# EAGLE design Avionics_Main_Board (EAGLE 9.2.2)

## Sheet 1 of 3
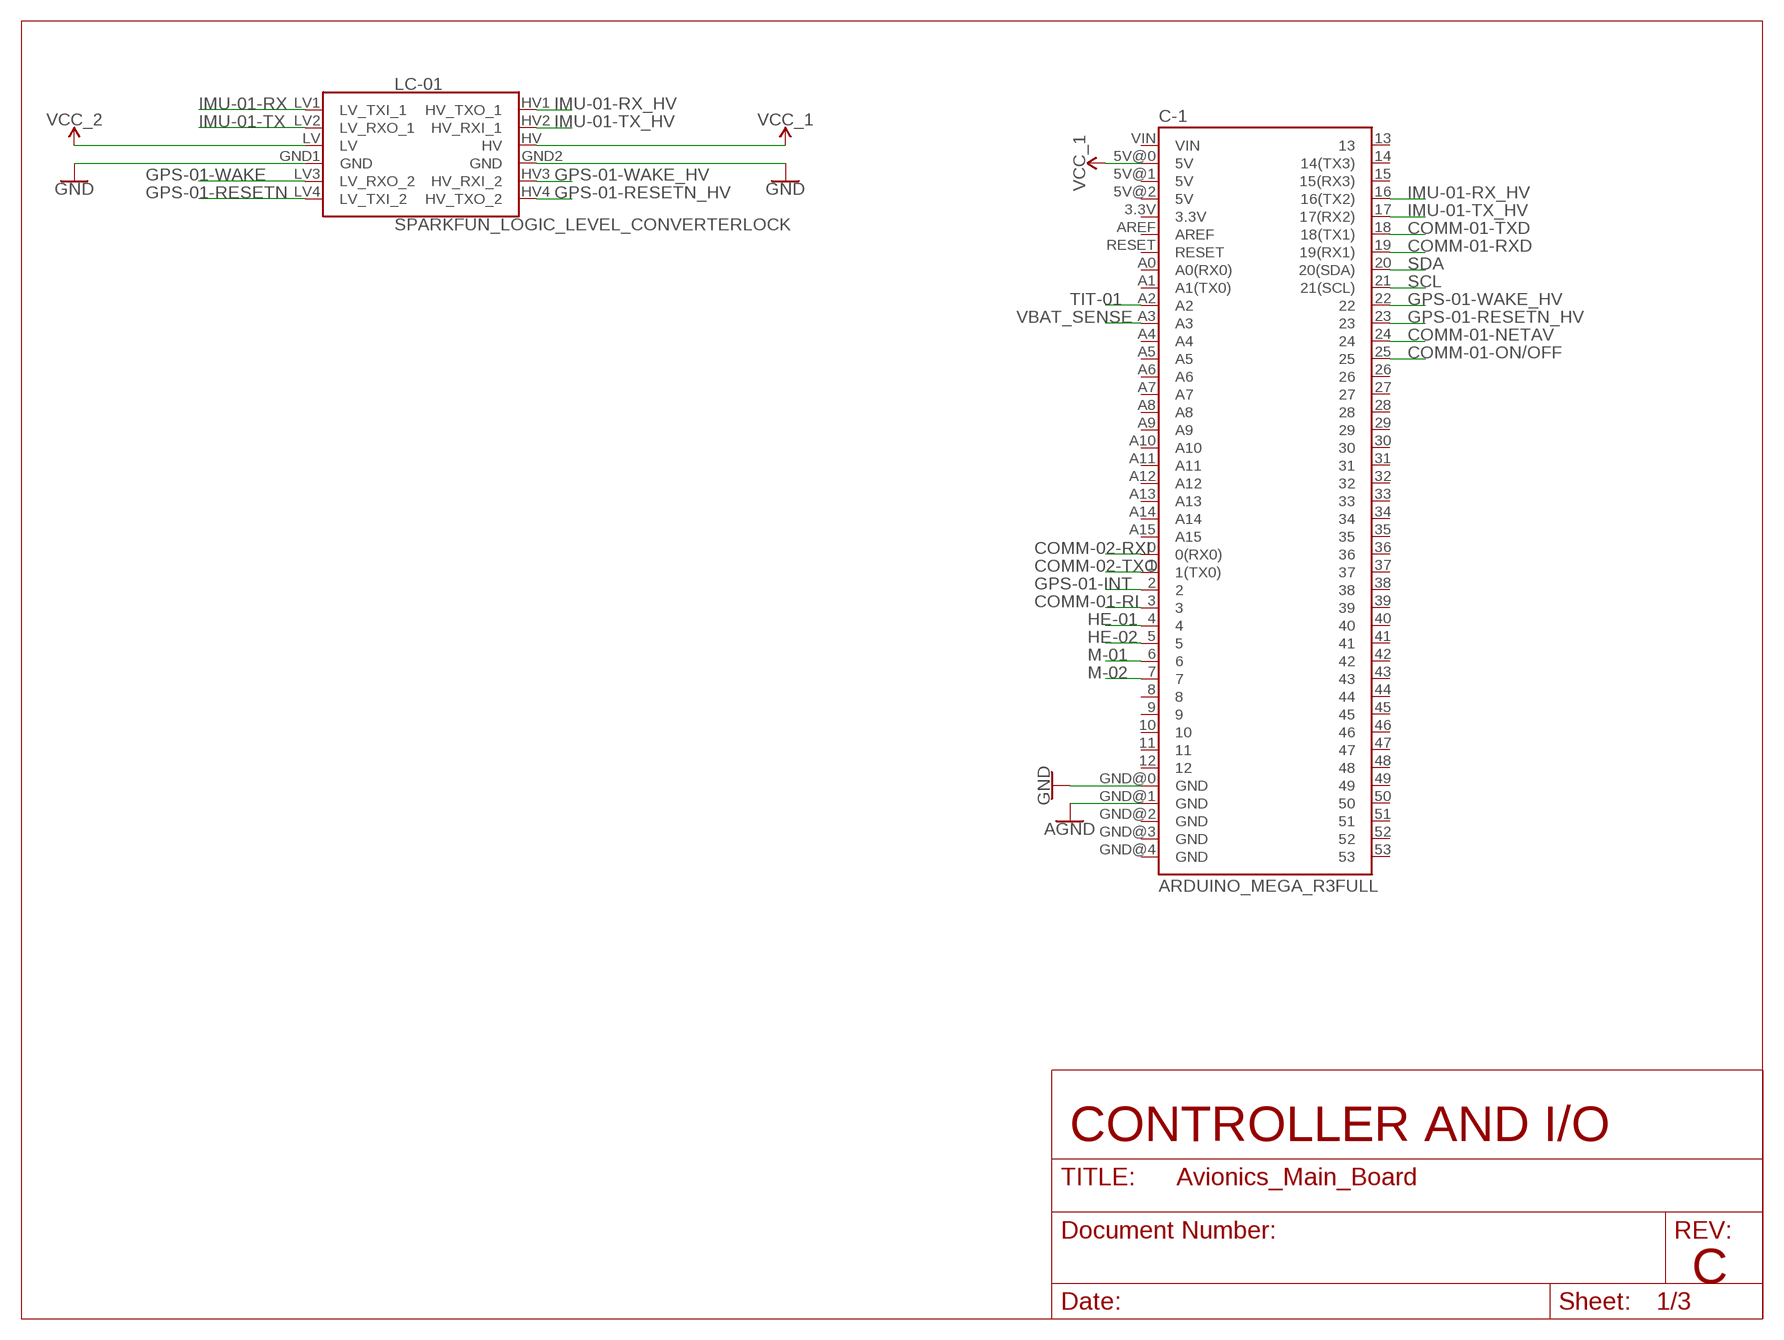
[diagram p0: schematic, sheet 1]

### Parts
C-1  ARDUINO_MEGA_R3FULL  [ARDUINO_MEGA]
LC-01  SPARKFUN_LOGIC_LEVEL_CONVERTERLOCK  [SPARKFUN_LOGIC_LEVEL_CONVERTER_LOCK]

### Nets
AGND: C-1.GND@1(GND) ; also sheet 3
COMM-01-NETAV: C-1.24 ; also sheet 3
COMM-01-ON/OFF: C-1.25 ; also sheet 3
COMM-01-RI: C-1.3 ; also sheet 3
COMM-01-RXD: C-1.19(19(RX1)) ; also sheet 3
COMM-01-TXD: C-1.18(18(TX1)) ; also sheet 3
COMM-02-RXI: C-1.0(0(RX0)) ; also sheet 3
COMM-02-TXO: C-1.1(1(TX0)) ; also sheet 3
GND: C-1.GND@0(GND) LC-01.GND1(GND) LC-01.GND2(GND) ; also sheet 2,3
GPS-01-INT: C-1.2 ; also sheet 3
GPS-01-RESETN: LC-01.LV4(LV_TXI_2) ; also sheet 3
GPS-01-RESETN_HV: C-1.23 LC-01.HV4(HV_TXO_2)
GPS-01-WAKE: LC-01.LV3(LV_RXO_2) ; also sheet 3
GPS-01-WAKE_HV: C-1.22 LC-01.HV3(HV_RXI_2)
HE-01: C-1.4 ; also sheet 2
HE-02: C-1.5 ; also sheet 2
IMU-01-RX: LC-01.LV1(LV_TXI_1) ; also sheet 3
IMU-01-RX_HV: C-1.16(16(TX2)) LC-01.HV1(HV_TXO_1)
IMU-01-TX: LC-01.LV2(LV_RXO_1) ; also sheet 3
IMU-01-TX_HV: C-1.17(17(RX2)) LC-01.HV2(HV_RXI_1)
M-01: C-1.6 ; also sheet 2
M-02: C-1.7 ; also sheet 2
SCL: C-1.21(21(SCL)) ; also sheet 3
SDA: C-1.20(20(SDA)) ; also sheet 3
TIT-01: C-1.A2 ; also sheet 3
VBAT_SENSE: C-1.A3 ; also sheet 3
VCC_1 [power]: C-1.5V@0(5V) LC-01.HV ; also sheet 2,3
VCC_2 [power]: LC-01.LV ; also sheet 2,3
Unconnected: C-1.3.3V C-1.5V@1(5V) C-1.5V@2(5V) C-1.8 C-1.9 C-1.10 C-1.11 C-1.12 C-1.13 C-1.14(14(TX3)) C-1.15(15(RX3)) C-1.26 C-1.27 C-1.28 C-1.29 C-1.30 C-1.31 C-1.32 C-1.33 C-1.34 C-1.35 C-1.36 C-1.37 C-1.38 C-1.39 C-1.40 C-1.41 C-1.42 C-1.43 C-1.44 C-1.45 C-1.46 C-1.47 C-1.48 C-1.49 C-1.50 C-1.51 C-1.52 C-1.53 C-1.A0(A0(RX0)) C-1.A1(A1(TX0)) C-1.A4 C-1.A5 C-1.A6 C-1.A7 C-1.A8 C-1.A9 C-1.A10 C-1.A11 C-1.A12 C-1.A13 C-1.A14 C-1.A15 C-1.AREF C-1.GND@2(GND) C-1.GND@3(GND) C-1.GND@4(GND) C-1.RESET C-1.VIN

### Notes on the sheet
- CONTROLLER AND I/O
- C

## Sheet 2 of 3
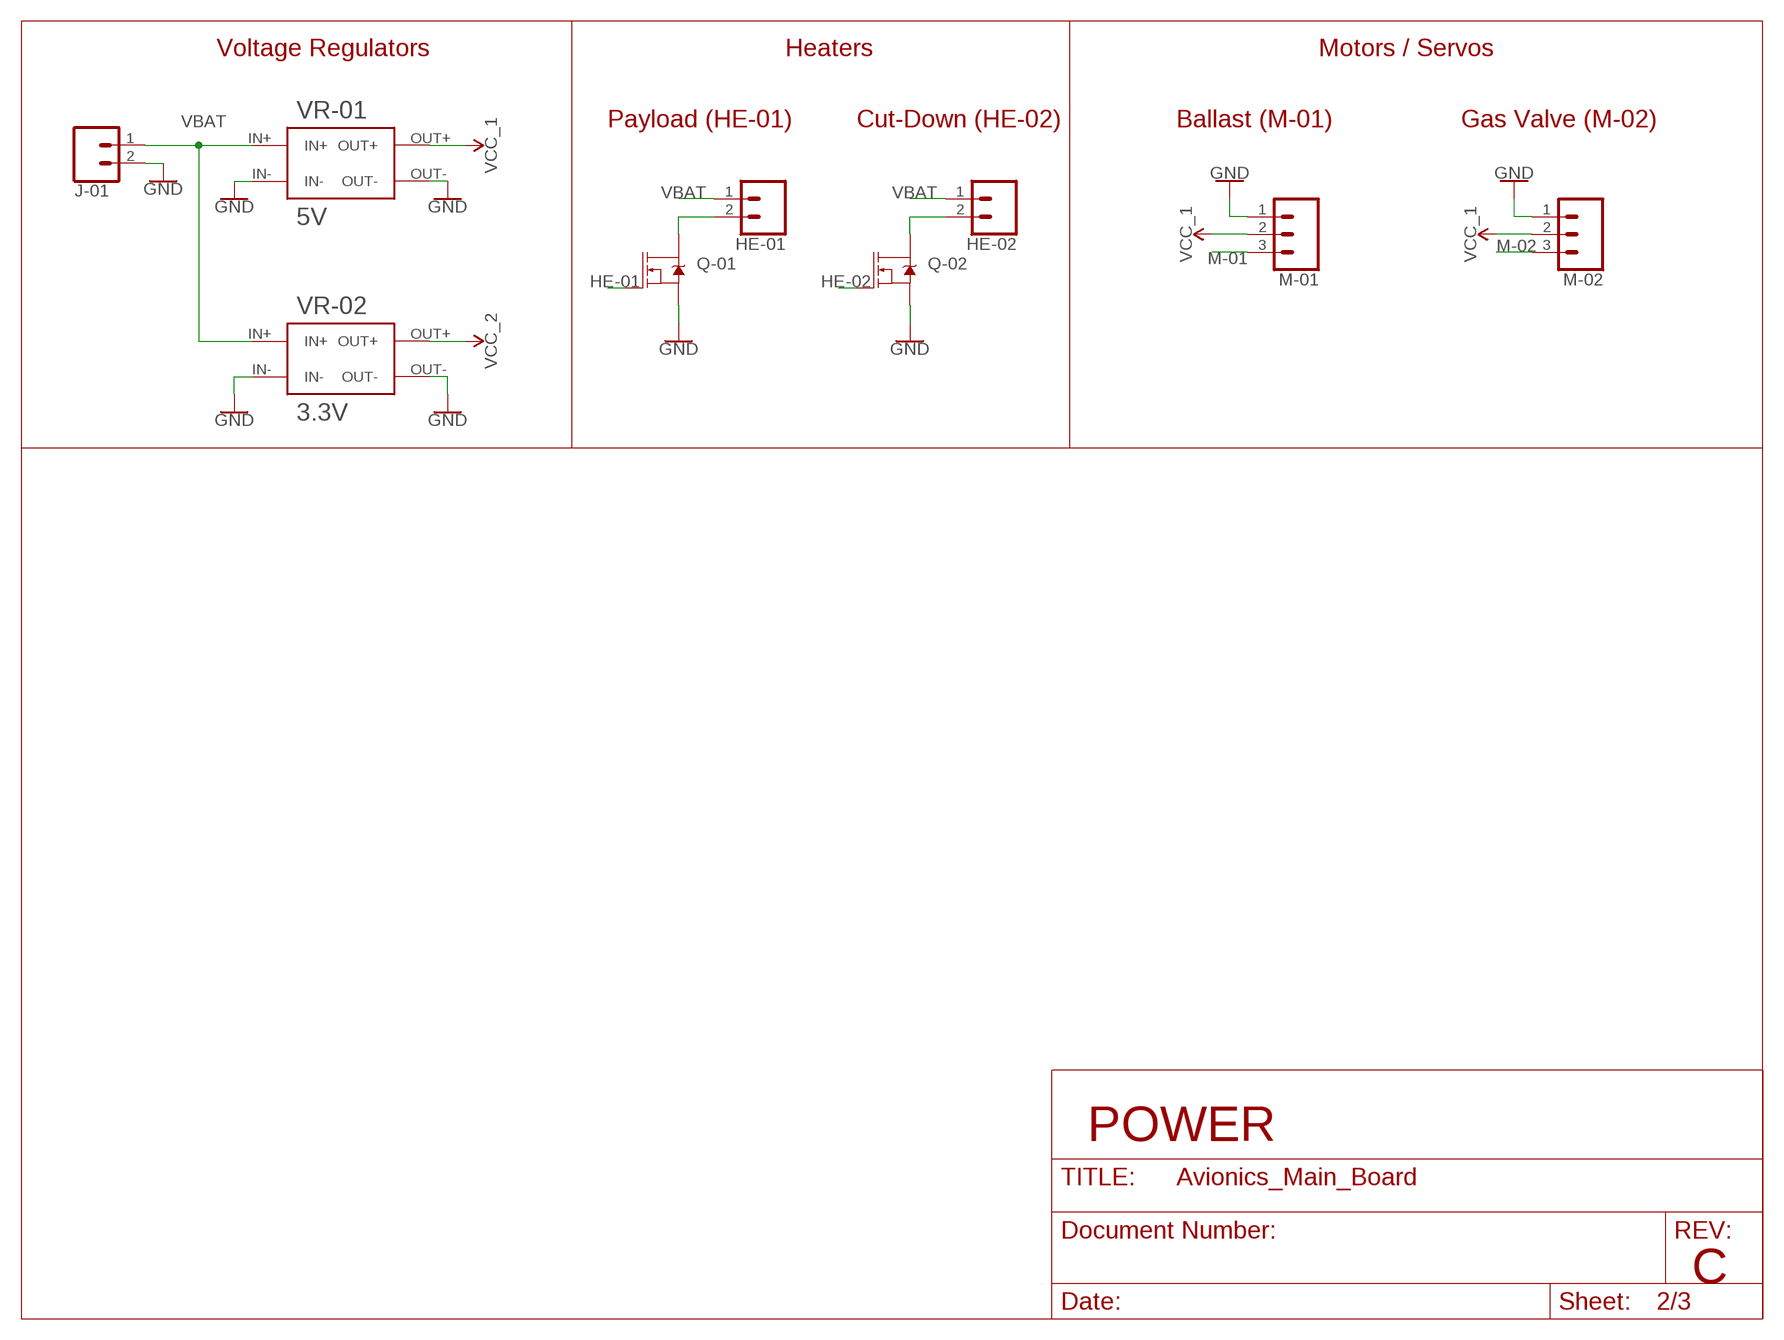
[diagram p1: schematic, sheet 2]

### Parts
HE-01  CONN_02LOCK  [1X02_LOCK]
HE-02  CONN_02LOCK  [1X02_LOCK]
J-01  CONN_023.5MM_LOCK  [SCREWTERMINAL-3.5MM-2_LOCK]
M-01  CONN_03LOCK  [1X03_LOCK]
M-02  CONN_03LOCK  [1X03_LOCK]
Q-01  MOSFET-NCH-FQP30N06L  [TO220V]
Q-02  MOSFET-NCH-FQP30N06L  [TO220V]
VR-01  5V  RIORAND_LM2596_BREAKOUT  [RIORAND_LM2596_BREAKOUT]
VR-02  3.3V  RIORAND_LM2596_BREAKOUT  [RIORAND_LM2596_BREAKOUT]

### Nets
GND: J-01.2 M-01.1 M-02.1 Q-01.3(S) Q-02.3(S) VR-01.IN- VR-01.OUT- VR-02.IN- VR-02.OUT- ; also sheet 1,3
HE-01: Q-01.1(G) ; also sheet 1
HE-01_OUT [power]: HE-01.2 Q-01.2(D)
HE-02: Q-02.1(G) ; also sheet 1
HE-02_OUT [power]: HE-02.2 Q-02.2(D)
M-01: M-01.3 ; also sheet 1
M-02: M-02.3 ; also sheet 1
VBAT [power]: HE-01.1 HE-02.1 J-01.1 VR-01.IN+ VR-02.IN+ ; also sheet 3
VCC_1 [power]: M-01.2 M-02.2 VR-01.OUT+ ; also sheet 1,3
VCC_2 [power]: VR-02.OUT+ ; also sheet 1,3

### Notes on the sheet
- Voltage Regulators | Heaters | Motors / Servos
- Payload (HE-01) | Cut-Down (HE-02) | Ballast (M-01) | Gas Valve (M-02)
- POWER
- C

## Sheet 3 of 3
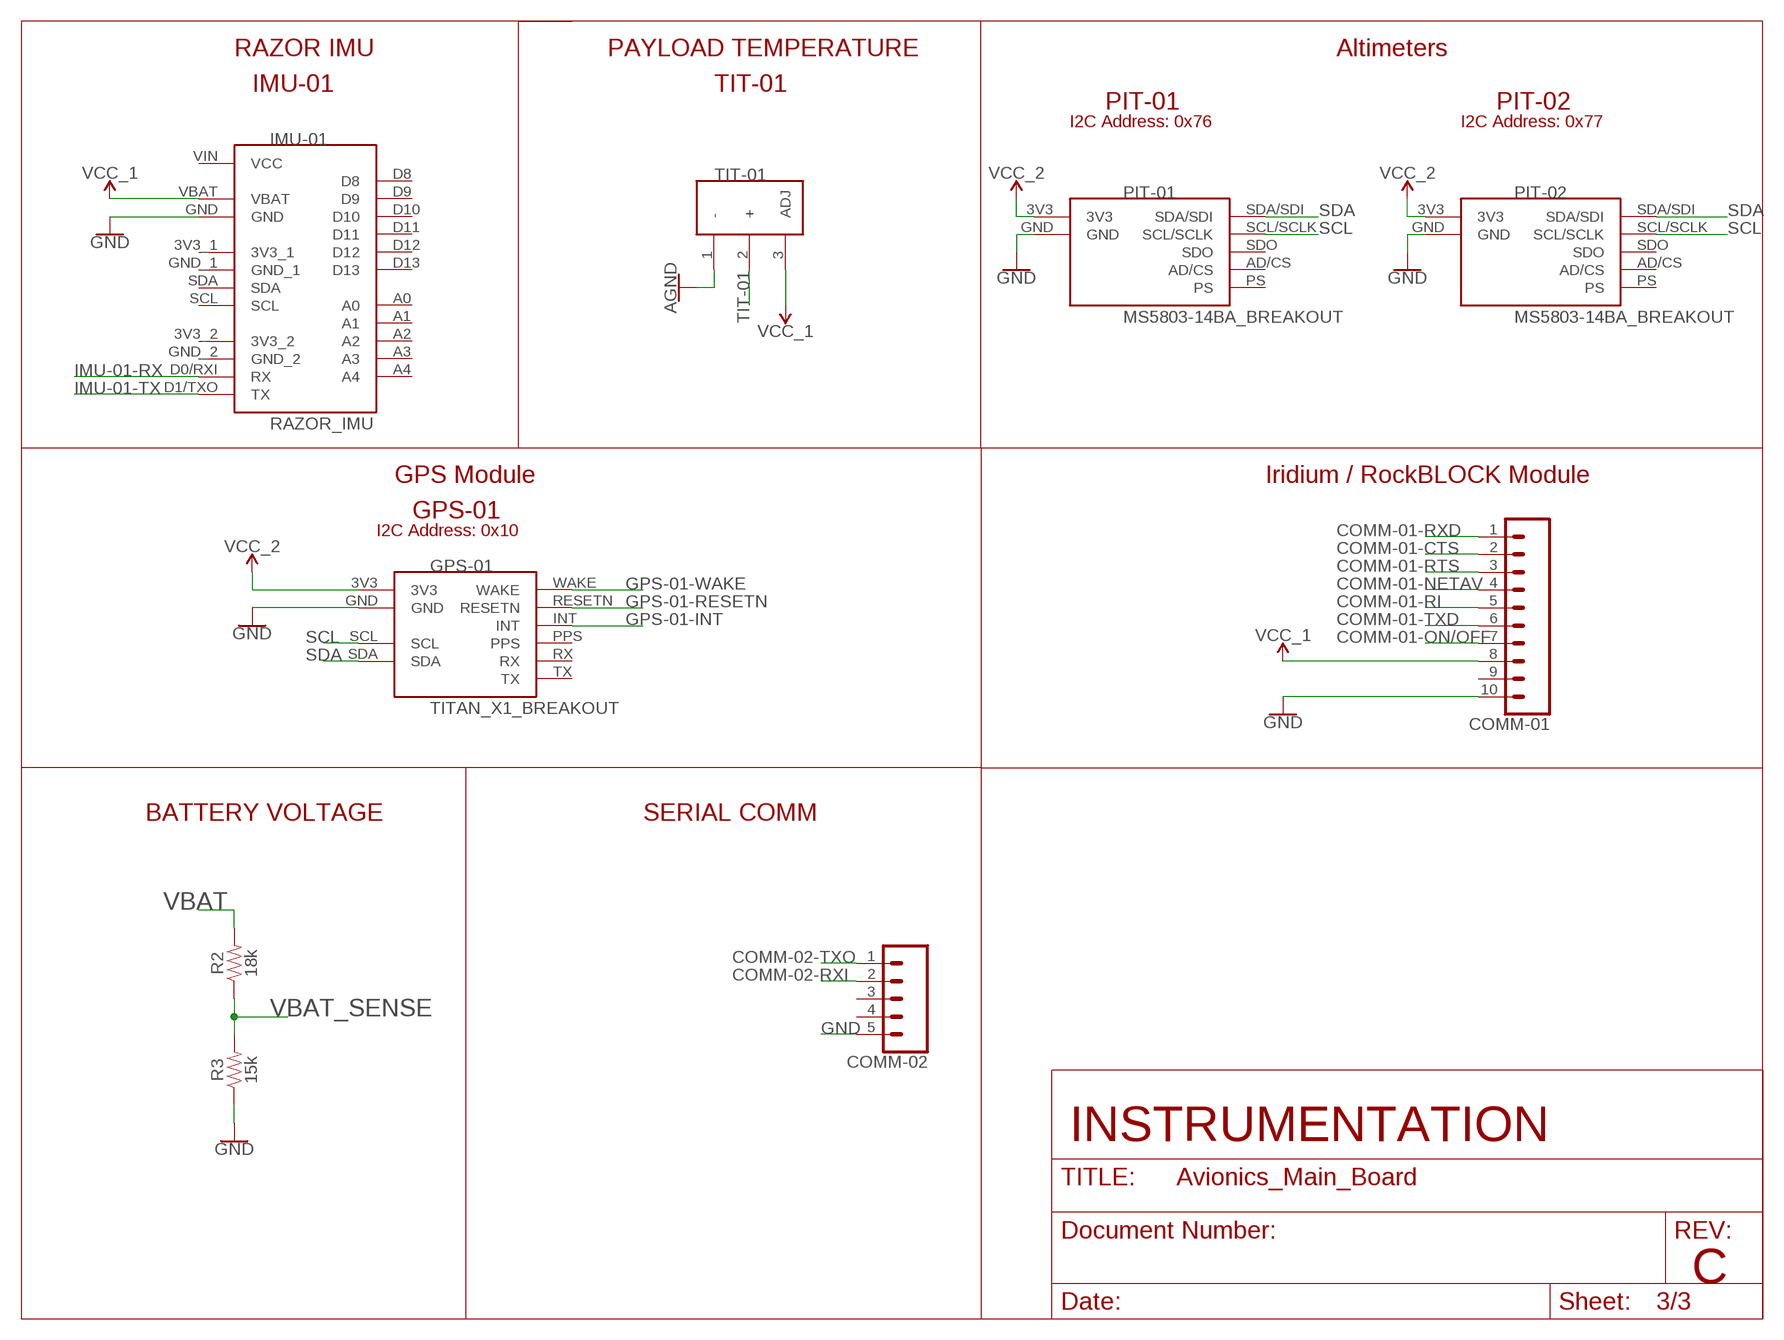
[diagram p2: schematic, sheet 3]

### Parts
COMM-01  CONN_10"  [1X10]
COMM-02  CONN_05LOCK  [1X05_LOCK]
GPS-01  TITAN_X1_BREAKOUT  [QWIIC_TITAN_X1_BREAKOUT]
IMU-01  RAZOR_IMU  [RAZOR_IMU]
PIT-01  MS5803-14BA_BREAKOUT  [MS5803-14BA_BREAKOUT]
PIT-02  MS5803-14BA_BREAKOUT  [MS5803-14BA_BREAKOUT]
R2  18k  1KOHM-HORIZ-1/4W-5%  [AXIAL-0.3]
R3  15k  1KOHM-HORIZ-1/4W-5%  [AXIAL-0.3]
TIT-01  LM335TO-92  [TO92]

### Nets
5V [power]: TIT-01.3(ADJ) ; supply symbol labelled VCC_1
AGND: TIT-01.1(-) ; also sheet 1
COMM-01-CTS: COMM-01.2
COMM-01-NETAV: COMM-01.4 ; also sheet 1
COMM-01-ON/OFF: COMM-01.7 ; also sheet 1
COMM-01-RI: COMM-01.5 ; also sheet 1
COMM-01-RTS: COMM-01.3
COMM-01-RXD: COMM-01.1 ; also sheet 1
COMM-01-TXD: COMM-01.6 ; also sheet 1
COMM-02-RXI: COMM-02.2 ; also sheet 1
COMM-02-TXO: COMM-02.1 ; also sheet 1
GND: COMM-01.10 COMM-02.5 GPS-01.GND IMU-01.GND PIT-01.GND PIT-02.GND R3.P$1 ; also sheet 1,2
GPS-01-INT: GPS-01.INT ; also sheet 1
GPS-01-RESETN: GPS-01.RESETN ; also sheet 1
GPS-01-WAKE: GPS-01.WAKE ; also sheet 1
IMU-01-RX: IMU-01.D0/RXI(RX) ; also sheet 1
IMU-01-TX: IMU-01.D1/TXO(TX) ; also sheet 1
SCL: GPS-01.SCL PIT-01.SCL/SCLK PIT-02.SCL/SCLK ; also sheet 1
SDA: GPS-01.SDA PIT-01.SDA/SDI PIT-02.SDA/SDI ; also sheet 1
TIT-01: TIT-01.2(+) ; also sheet 1
VBAT [power]: R2.P$2 ; also sheet 2
VBAT_SENSE: R2.P$1 R3.P$2 ; also sheet 1
VCC_1 [power]: COMM-01.8 IMU-01.VBAT ; also sheet 1,2
VCC_2 [power]: GPS-01.3V3 PIT-01.3V3 PIT-02.3V3 ; also sheet 1,2
Unconnected: COMM-01.9 COMM-02.3 COMM-02.4 GPS-01.PPS GPS-01.RX GPS-01.TX IMU-01.3V3_1 IMU-01.3V3_2 IMU-01.A0 IMU-01.A1 IMU-01.A2 IMU-01.A3 IMU-01.A4 IMU-01.D8 IMU-01.D9 IMU-01.D10 IMU-01.D11 IMU-01.D12 IMU-01.D13 IMU-01.GND_1 IMU-01.GND_2 IMU-01.SCL IMU-01.SDA IMU-01.VIN(VCC) PIT-01.AD/CS PIT-01.PS PIT-01.SDO PIT-02.AD/CS PIT-02.PS PIT-02.SDO

### Notes on the sheet
- RAZOR IMU | PAYLOAD TEMPERATURE | Altimeters
- IMU-01 | TIT-01
- PIT-01 | PIT-02
- I2C Address: 0x76 | I2C Address: 0x77
- GPS Module | Iridium / RockBLOCK Module
- GPS-01
- I2C Address: 0x10
- BATTERY VOLTAGE | SERIAL COMM
- INSTRUMENTATION
- C

## Library data of the parts
C-1 = SparkFun-Boards:ARDUINO_MEGA_R3: Arduino Mega R3 ATmega2560 R3 compatible footprint. SparkFun Products: Arduino Mega 2560 R3 <https://www.sparkfun.com/products/11061>
COMM-01 = SparkFun-Connectors:CONN_10: Multi connection point. Often used as Generic Header-pin footprint for 0.1 inch spaced/style header connections On any of the 0.1 inch spaced packages, you can populate with these: Break Away Headers - Straight <https://www.sparkfun.com/products/116> (PRT-00116) Break Away Male Headers - Right Angle <https://www.sparkfun.com/products/553> (PRT-00553) Female Headers <https://www.sparkfun.com/products/115> (PRT-00115) Break Away Headers - Machine Pin <https://www.sparkfun.com/products/117> (PRT-00117) Break Away Female Headers - Swiss Machine Pin <https://www.sparkfun.com/products/743> (PRT-00743) Arduino Stackable Header - 10 Pin <https://www.sparkfun.com/products/11376> (PRT-11376) For SCREWTERMINALS and SPRING TERMINALS visit here: Screw Terimnals on SparkFun.com <https://www.sparkfun.com/search/results?term=Screw+Terminals> (5mm/3.5mm/2.54mm spacing) This device is also useful as a general connection point to wire up your design to another part of your project. Our various solder wires solder well into these plated through hole pads. Hook-Up Wire - Assortment (Stranded, 22 AWG) <https://www.sparkfun.com/products/11375> (PRT-11375) Hook-Up Wire - Assortment (Solid Core, 22 AWG) <https://www.sparkfun.com/products/11367> (PRT-11367) View the entire wire category on our website here <https://www.sparkfun.com/categories/141> Special notes: Molex polarized connector foot print use with SKU : PRT-08231 with associated crimp pins and housings. 1MM SMD Version SKU: PRT-10208 NOTES ON THE VARIANTS LOCK and LOCK_LONGPADS... This footprint was designed to help hold the alignment of a through-hole component (i.e. 6-pin header) while soldering it into place. You may notice that each hole has been shifted either up or down by 0.005 of an inch from it's more standard position (which is a perfectly straight line). This slight alteration caused the pins (the squares in the middle) to touch the edges of the holes. Because they are alternating, it causes a "brace" to hold the component in place. 0.005 has proven to be the perfect amount of "off-center" position when using our standard breakaway headers. Although looks a little odd when you look at the bare footprint, once you have a header in there, the alteration is very hard to notice. Also,if you push a header all the way into place, it is covered up entirely on the bottom side.; PROD_ID: CONN-11563
COMM-02 = SparkFun-Connectors:CONN_05: Multi connection point. Often used as Generic Header-pin footprint for 0.1 inch spaced/style header connections On any of the 0.1 inch spaced packages, you can populate with these: Break Away Headers - Straight <https://www.sparkfun.com/products/116> (PRT-00116) Break Away Male Headers - Right Angle <https://www.sparkfun.com/products/553> (PRT-00553) Female Headers <https://www.sparkfun.com/products/115> (PRT-00115) Break Away Headers - Machine Pin <https://www.sparkfun.com/products/117> (PRT-00117) Break Away Female Headers - Swiss Machine Pin <https://www.sparkfun.com/products/743> (PRT-00743) For SCREWTERMINALS and SPRING TERMINALS visit here: Screw Terimnals on SparkFun.com <https://www.sparkfun.com/search/results?term=Screw+Terminals> (5mm/3.5mm/2.54mm spacing) This device is also useful as a general connection point to wire up your design to another part of your project. Our various solder wires solder well into these plated through hole pads. Hook-Up Wire - Assortment (Stranded, 22 AWG) <https://www.sparkfun.com/products/11375> (PRT-11375) Hook-Up Wire - Assortment (Solid Core, 22 AWG) <https://www.sparkfun.com/products/11367> (PRT-11367) View the entire wire category on our website here <https://www.sparkfun.com/categories/141> Special notes: Molex polarized connector foot print use with SKU : PRT-08231 with associated crimp pins and housings. 1MM SMD Version SKU: PRT-10208
GPS-01 = High Ball Library:TITAN_X1_BREAKOUT
HE-01 HE-02 = SparkFun-Connectors:CONN_02: Multi connection point. Often used as Generic Header-pin footprint for 0.1 inch spaced/style header connections On any of the 0.1 inch spaced packages, you can populate with these: Break Away Headers - Straight <https://www.sparkfun.com/products/116> (PRT-00116) Break Away Male Headers - Right Angle <https://www.sparkfun.com/products/553> (PRT-00553) Female Headers <https://www.sparkfun.com/products/115> (PRT-00115) Break Away Headers - Machine Pin <https://www.sparkfun.com/products/117> (PRT-00117) Break Away Female Headers - Swiss Machine Pin <https://www.sparkfun.com/products/743> (PRT-00743) For SCREWTERMINALS and SPRING TERMINALS visit here: Screw Terimnals on SparkFun.com <https://www.sparkfun.com/search/results?term=Screw+Terminals> (5mm/3.5mm/2.54mm spacing) This device is also useful as a general connection point to wire up your design to another part of your project. Our various solder wires solder well into these plated through hole pads. Hook-Up Wire - Assortment (Stranded, 22 AWG) <https://www.sparkfun.com/products/11375> (PRT-11375) Hook-Up Wire - Assortment (Solid Core, 22 AWG) <https://www.sparkfun.com/products/11367> (PRT-11367) View the entire wire category on our website here <https://www.sparkfun.com/categories/141> Special notes: Molex polarized connector foot print use with: PRT-08233 with associated crimp pins and housings. 2.54_SCREWTERM for use with PRT-10571. 3.5mm Screw Terminal footprints for PRT-08084 5mm Screw Terminal footprints for use with PRT-08432
IMU-01 = High Ball Library:RAZOR_IMU
J-01 = SparkFun-Connectors:CONN_02: Multi connection point. Often used as Generic Header-pin footprint for 0.1 inch spaced/style header connections On any of the 0.1 inch spaced packages, you can populate with these: Break Away Headers - Straight <https://www.sparkfun.com/products/116> (PRT-00116) Break Away Male Headers - Right Angle <https://www.sparkfun.com/products/553> (PRT-00553) Female Headers <https://www.sparkfun.com/products/115> (PRT-00115) Break Away Headers - Machine Pin <https://www.sparkfun.com/products/117> (PRT-00117) Break Away Female Headers - Swiss Machine Pin <https://www.sparkfun.com/products/743> (PRT-00743) For SCREWTERMINALS and SPRING TERMINALS visit here: Screw Terimnals on SparkFun.com <https://www.sparkfun.com/search/results?term=Screw+Terminals> (5mm/3.5mm/2.54mm spacing) This device is also useful as a general connection point to wire up your design to another part of your project. Our various solder wires solder well into these plated through hole pads. Hook-Up Wire - Assortment (Stranded, 22 AWG) <https://www.sparkfun.com/products/11375> (PRT-11375) Hook-Up Wire - Assortment (Solid Core, 22 AWG) <https://www.sparkfun.com/products/11367> (PRT-11367) View the entire wire category on our website here <https://www.sparkfun.com/categories/141> Special notes: Molex polarized connector foot print use with: PRT-08233 with associated crimp pins and housings. 2.54_SCREWTERM for use with PRT-10571. 3.5mm Screw Terminal footprints for PRT-08084 5mm Screw Terminal footprints for use with PRT-08432; PROD_ID: CONN-08399
LC-01 = SparkFun-Boards:SPARKFUN_LOGIC_LEVEL_CONVERTER: SparkFun Logic Level Converter -Bi-Directional This is the mechnical outline for the 3.3V - 5V bi directional logic level converter. *Note, the "LOCK" Package has the header pins staggered by an offset of 5 mils (off center line), so that when you slide a row of standard 0.1" headers into the PTH pads, it will hold position vertically. See the follwing turorial for more information on this type of special footprints: Sneaky Footprints <https://www.sparkfun.com/tutorials/114> SparkFun Products: SparkFun Logic Level Converter - Bi-Directional <https://www.sparkfun.com/products/12009>
M-01 M-02 = SparkFun-Connectors:CONN_03: Multi connection point. Often used as Generic Header-pin footprint for 0.1 inch spaced/style header connections On any of the 0.1 inch spaced packages, you can populate with these: Break Away Headers - Straight <https://www.sparkfun.com/products/116> (PRT-00116) Break Away Male Headers - Right Angle <https://www.sparkfun.com/products/553> (PRT-00553) Female Headers <https://www.sparkfun.com/products/115> (PRT-00115) Break Away Headers - Machine Pin <https://www.sparkfun.com/products/117> (PRT-00117) Break Away Female Headers - Swiss Machine Pin <https://www.sparkfun.com/products/743> (PRT-00743) Stackable Header - 3 Pin (Female, 0.1") <https://www.sparkfun.com/products/13875> (PRT-13875) For SCREWTERMINALS and SPRING TERMINALS visit here: Screw Terimnals on SparkFun.com <https://www.sparkfun.com/search/results?term=Screw+Terminals> (5mm/3.5mm/2.54mm spacing) This device is also useful as a general connection point to wire up your design to another part of your project. Our various solder wires solder well into these plated through hole pads. Hook-Up Wire - Assortment (Stranded, 22 AWG) <https://www.sparkfun.com/products/11375> (PRT-11375) Hook-Up Wire - Assortment (Solid Core, 22 AWG) <https://www.sparkfun.com/products/11367> (PRT-11367) View the entire wire category on our website here <https://www.sparkfun.com/categories/141> Special notes: Molex polarized connector foot print use with SKU : PRT-08232 with associated crimp pins and housings.
PIT-01 PIT-02 = High Ball Library:MS5803-14BA_BREAKOUT
Q-01 Q-02 = SparkFun-DiscreteSemi:MOSFET-NCH: N-channel MOSFETs Voltage controlled devices that allow control of high current outputs. SparkFun Products: SparkFun OpenScale <https://www.sparkfun.com/products/13261> SparkFun Digital Sandbox <https://www.sparkfun.com/products/12651> SparkFun Monster Moto Shield <https://www.sparkfun.com/products/10182> SparkFun MOSFET Power Controller <https://www.sparkfun.com/products/11214>; PROD_ID: TRANS-10060; VALUE: 60V/32A/35mΩ
R2 R3 = SparkFun-Resistors:1KOHM: 1kΩ resistor A resistor is a passive two-terminal electrical component that implements electrical resistance as a circuit element. Resistors act to reduce current flow, and, at the same time, act to lower voltage levels within circuits. - Wikipedia; PROD_ID: RES-08380; VALUE: 1k
TIT-01 = High Ball Library:LM335
VR-01 VR-02 = High Ball Library:RIORAND_LM2596_BREAKOUT

## Net classes
0 default: width 0.635 mm, drill 0.899 mm, clearance 0.381 mm
1 power: width 1.016 mm, drill 0.899 mm, clearance 0.762 mm

## Board
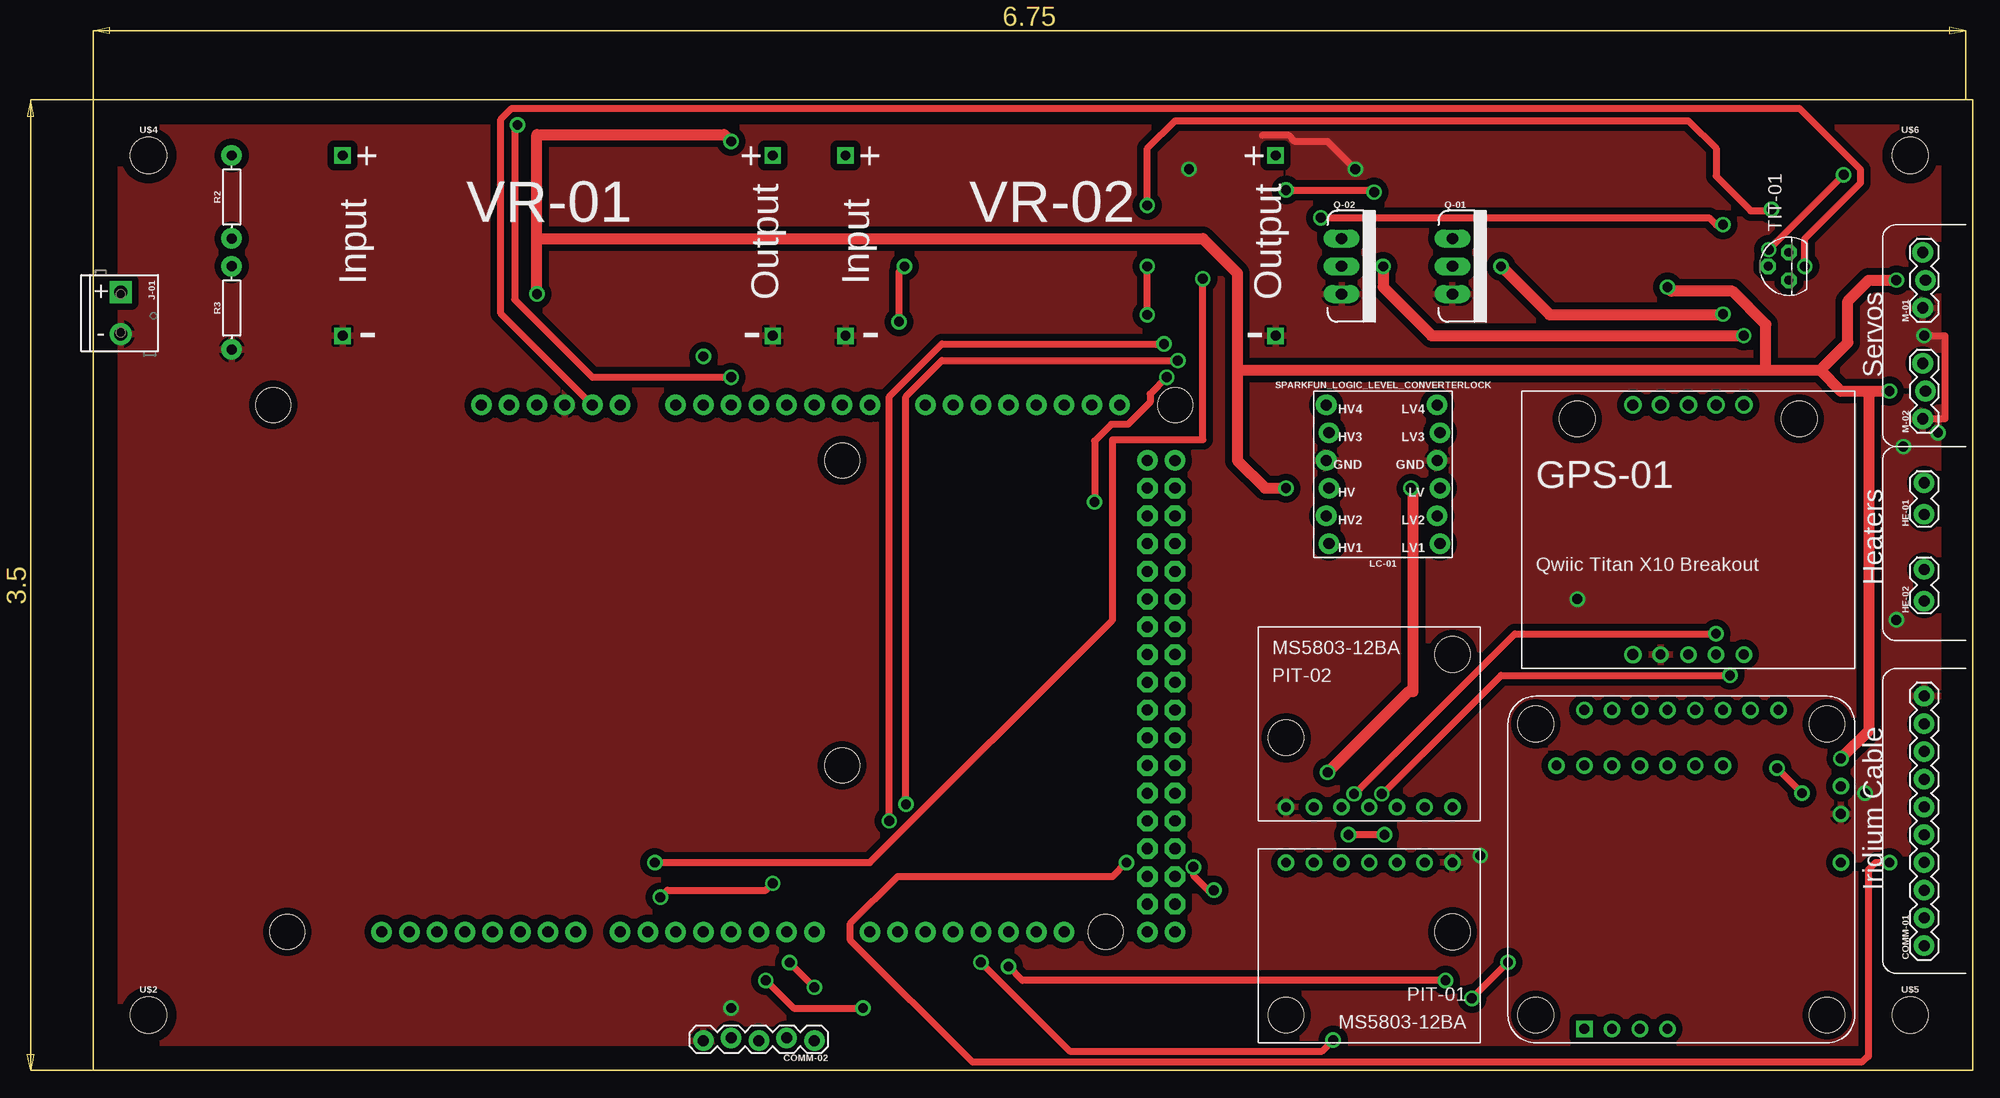
[diagram p3: board, top side]
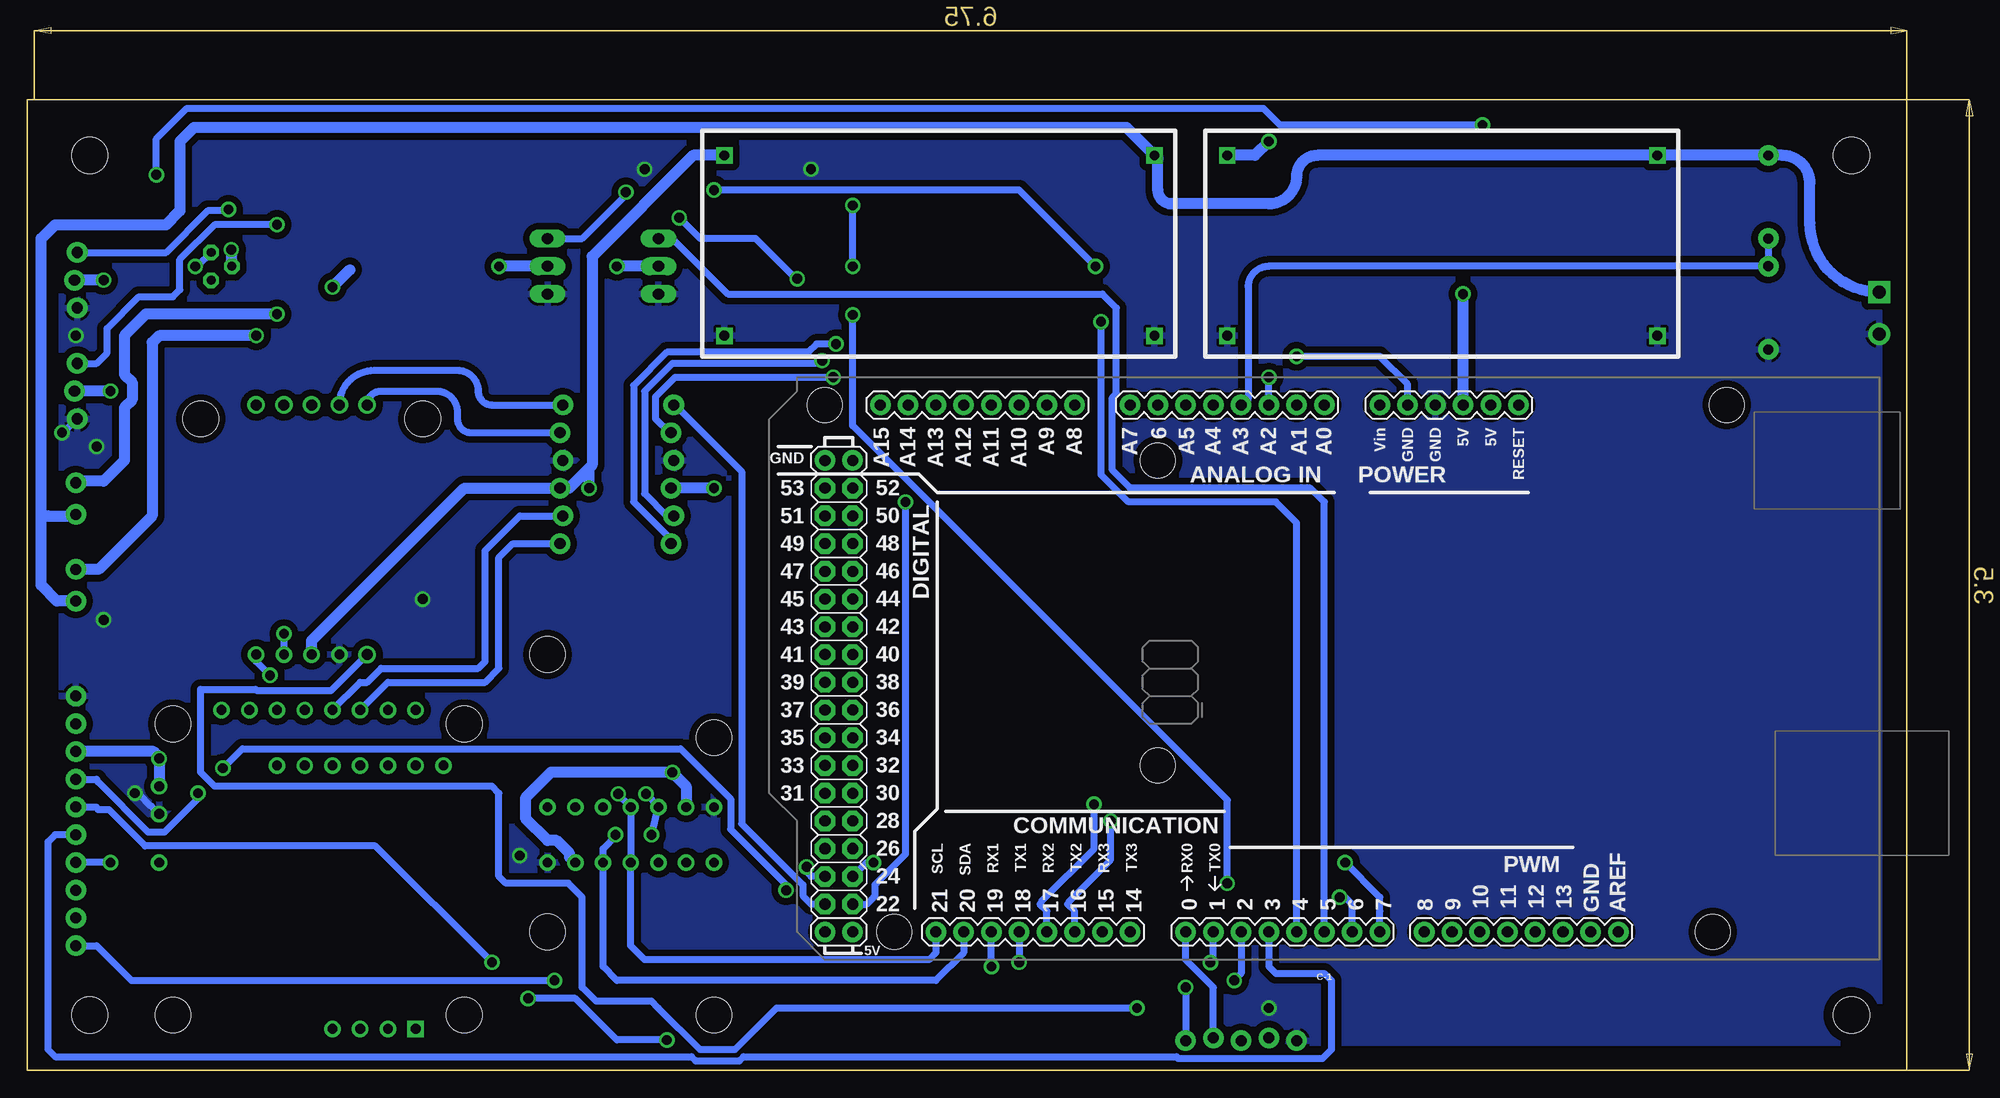
[diagram p4: board, bottom side, seen from below]

Size 172.09 x 88.9 mm. Coordinates in mm from the lower left corner, seen from the top.
Outline: 0,0 172.09,0 172.09,88.9 0,88.9 0,0
Copper layers (1*16): Top 0.035mm / dielectric 1.5mm / Bottom 0.035mm
Design rules "SparkFun": minimum track width 8mil, minimum drill 20mil, track to track 8mil, track to pad 8mil, pad to pad 8mil, via to via 8mil, smd to smd 8mil, copper to edge 10mil, drill to drill 8mil, minimum pad ring 12mil, minimum via ring 10mil, stop-mask expansion 4mil, vias tented up to drill 25mil, thermal gap 10mil

### Footprints (pad centres in the part's own frame; a part is rotated, then mirrored left to right if it is on the bottom)
ARDUINO_MEGA = drill 1.016 pad 1.88: 0 13.97,24.13; 1 11.43,24.13; 2 8.89,24.13; 3 6.35,24.13; 3.3V -13.97,-24.13; 4 3.81,24.13; 5 1.27,24.13; 5V@0 -11.43,-24.13; 5V@1 44.45,24.13; 5V@2 46.99,24.13; 6 -1.27,24.13; 7 -3.81,24.13; 8 -7.874,24.13; 9 -10.414,24.13; 10 -12.954,24.13; 11 -15.494,24.13; 12 -18.034,24.13; 13 -20.574,24.13; 14 19.05,24.13; 15 21.59,24.13; 16 24.13,24.13; 17 26.67,24.13; 18 29.21,24.13; 19 31.75,24.13; 20 34.29,24.13; 21 36.83,24.13; A0 1.27,-24.13; A1 3.81,-24.13; A2 6.35,-24.13; A3 8.89,-24.13; A4 11.43,-24.13; A5 13.97,-24.13; A6 16.51,-24.13; A7 19.05,-24.13; A8 24.13,-24.13; A9 26.67,-24.13; A10 29.21,-24.13; A11 31.75,-24.13; A12 34.29,-24.13; A13 36.83,-24.13; A14 39.37,-24.13; A15 41.91,-24.13; AREF -25.654,24.13; GND@0 -8.89,-24.13; GND@1 -6.35,-24.13; GND@2 44.45,-19.05; GND@3 46.99,-19.05; GND@4 -23.114,24.13; RESET -16.51,-24.13; VIN -3.81,-24.13 | drill 1.016 pad 1.88 octagon: 22 44.45,21.59; 23 46.99,21.59; 24 44.45,19.05; 25 46.99,19.05; 26 44.45,16.51; 27 46.99,16.51; 28 44.45,13.97; 29 46.99,13.97; 30 44.45,11.43; 31 46.99,11.43; 32 44.45,8.89; 33 46.99,8.89; 34 44.45,6.35; 35 46.99,6.35; 36 44.45,3.81; 37 46.99,3.81; 38 44.45,1.27; 39 46.99,1.27; 40 44.45,-1.27; 41 46.99,-1.27; 42 44.45,-3.81; 43 46.99,-3.81; 44 44.45,-6.35; 45 46.99,-6.35; 46 44.45,-8.89; 47 46.99,-8.89; 48 44.45,-11.43; 49 46.99,-11.43; 50 44.45,-13.97; 51 46.99,-13.97; 52 44.45,-16.51; 53 46.99,-16.51 | hole 3.2: -34.29,24.13; -35.56,-24.13; 16.51,8.89; 16.51,-19.05; 40.64,24.13; 46.99,-24.13
1X10 = drill 1.016 pad 1.88: 1 0,0; 2 2.54,0; 3 5.08,0; 4 7.62,0; 5 10.16,0; 6 12.7,0; 7 15.24,0; 8 17.78,0; 9 20.32,0; 10 22.86,0
1X05_LOCK = drill 1.016 pad 1.88: 1 0,0.127; 2 2.54,-0.127; 3 5.08,0.127; 4 7.62,-0.127; 5 10.16,0.127
QWIIC_TITAN_X1_BREAKOUT = drill 0.9: 3V3 15.24,1.27; GND 12.7,1.27; SCL 20.32,1.27; SDA 17.78,1.27 | drill 1: INT 10.16,1.27; PPS 15.24,24.13; RESETN 12.7,24.13; RX 17.78,24.13; TX 20.32,24.13; WAKE 10.16,24.13 | hole 3.264: 5.08,22.86; 25.4,22.86
1X02_LOCK = drill 1.016 pad 1.88: 1 -0.178,0; 2 2.718,0
RAZOR_IMU = drill 0.9: 3V3_1 1.27,22.225; 3V3_2 30.48,22.225; A0 25.4,12.065; A1 25.4,14.605; A2 25.4,17.145; A3 25.4,19.685; A4 25.4,22.225; D0/RXI 30.48,19.685; D1/TXO 30.48,17.145; D8 25.4,24.765; D9 25.4,27.305; D10 30.48,14.605; D11 30.48,12.065; D12 30.48,9.525; D13 30.48,6.985; GND 20.955,1.27; GND_2 30.48,24.765; SCL 1.27,17.145; SDA 1.27,19.685; VBAT 23.495,1.27; VIN 16.51,1.27 | drill 0.9 square: GND_1 1.27,24.765 | hole 3.264: 2.54,2.54; 29.21,2.54; 29.21,29.21; 2.54,29.21
SCREWTERMINAL-3.5MM-2_LOCK = drill 1.2 pad 2.032 square: 1 -0.178,0 | drill 1.2 pad 2.032: 2 3.678,0
SPARKFUN_LOGIC_LEVEL_CONVERTER_LOCK = drill 1.016 pad 1.88: GND1 -4.953,-1.27; GND2 5.207,-1.27; HV 4.953,1.27; HV1 4.953,6.35; HV2 5.207,3.81; HV3 4.953,-3.81; HV4 5.207,-6.35; LV -5.207,1.27; LV1 -5.207,6.35; LV2 -4.953,3.81; LV3 -5.207,-3.81; LV4 -4.953,-6.35
1X03_LOCK = drill 1.016 pad 1.88: 1 0,0.127; 2 2.54,-0.127; 3 5.08,0.127
MS5803-14BA_BREAKOUT = drill 0.9: 3V3 5.08,1.27; AD/CS 15.24,1.27; GND 2.54,1.27; PS 17.78,1.27; SCL/SCLK 10.16,1.27; SDA/SDI 7.62,1.27; SDO 12.7,1.27 | hole 3.264: 17.78,15.24; 2.54,7.62
TO220V = drill 1.016 long: 1 -2.54,0; 2 0,0; 3 2.54,0
AXIAL-0.3 = drill 0.9 pad 1.88: P$1 -3.81,0; P$2 3.81,0
TO92 = drill 0.813 octagon: 1 1.27,0; 2 0,1.905; 3 -1.27,0
STAND-OFF = hole 3.302: 0,0
RIORAND_LM2596_BREAKOUT = drill 0.9 square: IN+ 0,16.51; IN- 0,0; OUT+ 39.37,16.51; OUT- 39.37,0

### Placement (x,y rotation side)
C-1  52.07,36.83 180 bottom
COMM-01  167.64,11.43 90 top
COMM-02  66.04,2.86 180 top
GPS-01  130.81,36.83 0 top
HE-01  167.64,51.12 90 top
HE-02  167.64,43.18 90 top
IMU-01  161.29,2.54 90 top
J-01  2.54,71.12 270 top
LC-01  118.11,54.61 180 top
M-01  167.64,69.85 90 top
M-02  167.64,59.69 90 top
PIT-01  127,20.32 180 top
PIT-02  106.68,22.86 0 top
Q-01  124.46,73.66 270 top
Q-02  114.3,73.66 270 top
R2  12.7,80.01 90 top
R3  12.7,69.85 90 top
TIT-01  155.26,73.66 90 top
U$2  [STAND-OFF]  5.08,5.08 0 top
U$4  [STAND-OFF]  5.08,83.82 0 top
U$5  [STAND-OFF]  166.37,5.08 0 top
U$6  [STAND-OFF]  166.37,83.82 0 top
VR-01  22.86,67.31 0 top
VR-02  68.9,67.31 0 top

### Tracks (layer width: path | path; a pad name or v marks a point on that pad's centre or on a via)
AGND  (via drill 0.9)
  Top 0.635: C-1.GND@1 37.34,69.34 37.34,87.12 38.35,88.14 156.21,88.14 161.8,82.55 161.8,81.28 156.78,76.26 156.71,76.19 v156.71,73.66
  Bottom 0.635: C-1.GND@1 45.72,62.87 48.26,65.41 v55.88,65.41 | TIT-01.1 156.53,73.66 v156.71,73.66
COMM-01-NETAV  (via drill 0.9)
  Top 0.635: v164.47,19.05 163.19,19.05 162.56,18.41 162.56,1.27 162.43,1.27 161.93,0.76 80.52,0.76 69.34,11.94 69.34,13.46 73.66,17.78 93.34,17.78 v94.61,19.05
  Bottom 0.635: v164.47,19.05 COMM-01.4 | v94.61,19.05 95.25,19.05 C-1.24
COMM-01-ON/OFF  (via drill 0.9)
  Top 0.635: v102.62,16.51 102.11,16.51 100.74,17.88 v100.74,18.64 | v156.46,25.4 v154.18,27.69
  Bottom 0.635: COMM-01.7 165.74,26.67 165.61,26.42 161.04,21.84 159.51,21.84 156.46,24.89 v156.46,25.4 | C-1.25 100.33,17.78 100.74,18.19 v100.74,18.64 | v102.62,16.51 102.62,17.02 107.7,22.1 107.7,24.89 112.27,29.46 152.4,29.46 v154.18,27.69
COMM-01-RI
  Bottom 0.635: COMM-01.5 169.54,21.59 170.18,20.95 170.18,1.91 169.54,1.27 111.29,1.27 110.91,0.89 106.89,0.89 106.51,1.27 66.9,1.27 66.72,1.09 53.52,1.09 52.7,1.91 52.7,8.26 53.34,8.89 57.78,8.89 58.42,9.53 C-1.3
COMM-01-RXD  (via drill 0.9)
  Top 0.635: v123.83,8.26 85.09,8.26 v83.82,9.53
  Bottom 0.635: COMM-01.1 165.74,11.43 162.56,8.26 v123.83,8.26 | v83.82,9.53 C-1.19
COMM-01-TXD  (via drill 0.9)
  Top 0.635: v126.24,6.6 v129.54,9.91 | v113.54,2.79 112.52,1.78 89.41,1.78 v81.28,9.91
  Bottom 0.635: COMM-01.6 165.74,24.13 165.61,23.88 164.59,23.88 161.29,20.57 140.21,20.57 v129.54,9.91 | v126.24,6.6 121.92,6.6 118.11,2.79 v113.54,2.79 | C-1.18 v81.28,9.91
COMM-02-RXI
  Bottom 0.635: C-1.0 66.04,10.16 63.5,7.62 COMM-02.2
COMM-02-TXO  (via drill 0.9)
  Top 0.635: v63.78,9.88 v66.04,7.62
  Bottom 0.635: 63.5,10.16 v63.78,9.88 63.5,10.16 | v66.04,7.62 COMM-02.1 | 63.5,10.16 C-1.1
GND  (via drill 0.9)
  Top 0.635: v167.64,67.31 169.53,67.31 169.53,59.69 M-02.1 | v115.57,82.55 113.03,85.09 110.03,85.09 109.47,85.65 107.07,85.65
  Bottom 0.635: M-02.1 168.78,58.42 v168.91,58.42 | IMU-01.GND 160.73,24.2 160.78,24.2 161.85,25.27 161.85,25.33 161.93,25.4 v162.24,25.4
  other vias: 135.89,43.18 127,19.68 100.33,82.55 165.1,41.27 165.74,57.15 58.42,5.71
  pour Top (isolate 0.61): 2.54,2.54 168.91,2.54 168.91,86.36 2.54,86.36
  pour Bottom (isolate 0.61): 2.54,2.54 168.91,2.54 168.91,86.36 2.54,86.36
GPS-01-INT  (via drill 0.9)
  Top 0.635: v61.59,8.26 64.14,5.71 v70.48,5.71
  Bottom 0.635: v61.59,8.26 60.96,8.89 C-1.2 | v70.48,5.71 103.5,5.71 | 103.5,5.71 | 103.5,5.71 107.31,1.91 110.49,1.91 114.3,5.71 114.94,6.35 120.02,6.35 121.28,7.62 121.28,15.88 122.56,17.14 128.27,17.14 128.91,17.78 128.91,25.4 129.54,26.04 154.94,26.04 156.21,27.3 156.21,34.92 151.21,34.92 151.08,34.79 144.28,34.79 GPS-01.INT
GPS-01-RESETN
  Bottom 0.635: GPS-01.RESETN arc90 140.34,64.14 132.72,64.14 arc90 130.81,62.23 arc-90 129.54,60.96 LC-01.LV4
GPS-01-RESETN_HV
  Bottom 0.635: C-1.23 100.33,15.24 100.97,15.88 101.09,16 101.09,17.02 106.68,22.61 106.68,54.86 112.78,60.96 LC-01.HV4
GPS-01-WAKE
  Bottom 0.635: GPS-01.WAKE arc90 139.7,62.23 134.62,62.23 arc90 132.72,60.33 132.72,59.69 arc-90 131.44,58.42 LC-01.LV3
GPS-01-WAKE_HV  (via drill 0.9)
  Top 0.635: v91.69,52.07 91.69,57.66 93.22,59.18 94.74,59.18 96.77,61.21 96.77,61.98 v98.3,63.5
  Bottom 0.635: C-1.22 95.25,15.24 94.61,15.88 94.49,16 94.49,17.02 91.69,19.81 v91.69,52.07 | v98.3,63.5 112.78,63.5 114.55,61.72 114.55,59.69 113.28,58.42 LC-01.HV3
HE-01  (via drill 0.9)
  Top 0.635: v73.79,68.58 73.79,73.16 v74.3,73.66 | v117.28,80.45 117.09,80.64 v109.22,80.64
  Bottom 0.635: C-1.4 55.88,14.61 | Q-01.1 121.28,76.2 | 121.28,76.2 | 121.28,76.2 117.16,80.33 v117.28,80.45 | 55.88,14.61 | 55.88,14.61 55.88,50.16 57.78,52.07 71.29,52.07 73.77,54.56 73.77,68.47 73.66,68.58 v73.79,68.58 | v74.3,73.66 81.28,80.64 v109.22,80.64
HE-01_OUT  (via drill 0.9)
  Top 1.016: v128.91,73.66 133.35,69.22 149.22,69.22 v149.22,69.28
  Bottom 1.016: Q-01.2 v128.91,73.66 | v149.22,69.28 161.22,69.28 163.19,67.31 163.19,63.75 162.49,63.05 162.49,61.41 163.19,60.71 163.19,55.88 165.1,53.98 167.5,53.98 HE-01.2
HE-02
  Bottom 0.635: Q-02.1 113.03,76.2 107.95,71.12 73.66,71.12 72.39,69.85 72.39,62.01 72.76,61.64 72.76,54.98 71.12,53.34 54.61,53.34 53.34,52.07 C-1.5
HE-02_OUT  (via drill 0.9)
  Top 1.016: v118.11,73.66 118.11,71.75 122.56,67.31 v151.13,67.31
  Bottom 1.016: Q-02.2 v118.11,73.66 | HE-02.2 165.56,45.9 160.66,50.8 160.66,66.67 160.02,67.31 v151.13,67.31
IMU-01-RX
  Bottom 0.635: IMU-01.D0/RXI 139.06,35.56 130.18,35.56 128.91,36.83 128.91,46.99 127.64,48.26 LC-01.LV1
IMU-01-RX_HV  (via drill 0.9)
  Top 0.635: v98.04,66.55 77.72,66.55 72.9,61.72 v72.9,22.86
  Bottom 0.635: C-1.16 76.2,14.61 76.83,15.24 76.71,15.49 72.9,19.3 v72.9,22.86 | v98.04,66.55 99.82,66.55 100.58,65.79 113.54,65.79 116.59,62.74 116.59,52.07 113.28,48.77 113.28,48.26 LC-01.HV1
IMU-01-TX
  Bottom 0.635: IMU-01.D1/TXO 141.6,35.56 140.97,35.56 139.7,36.83 130.81,36.83 130.18,37.47 130.18,47.62 127,50.8 LC-01.LV2
IMU-01-TX_HV  (via drill 0.9)
  Top 0.635: v99.31,65.02 77.72,65.02 74.42,61.72 v74.42,24.38
  Bottom 0.635: C-1.17 78.74,14.61 79.38,15.24 79.25,15.49 74.42,20.32 v74.42,24.38 | v99.31,65.02 99.57,64.77 113.03,64.77 115.57,62.23 115.57,52.83 113.54,50.8 113.03,50.8 LC-01.HV2
M-01  (via drill 0.9)
  Top 0.635: v51.94,15.88 52.57,16.51 61.59,16.51 v62.23,17.14 | v96.52,69.22 v96.52,73.66 | v96.52,79.24 96.52,84.45 99.06,87 146.05,87 148.59,84.45 148.59,81.92 151.76,78.74 153.67,78.74 v153.67,78.87
  Bottom 0.635: M-01.3 159.38,74.93 155.57,78.74 153.67,78.74 v153.67,78.87 | v51.94,15.88 51.44,15.88 50.8,15.24 C-1.6 | v62.23,17.14 62.23,24.77 96.52,59.05 v96.52,69.22 | v96.52,73.66 v96.52,79.24
M-02  (via drill 0.9)
  Top 0.635: v101.6,72.52 101.6,57.78 93.34,57.78 93.34,41.27 71.12,19.05 v51.44,19.05 | v112.39,78.11 147.96,78.11 148.59,77.47 v149.22,77.47
  Bottom 0.635: C-1.7 48.26,14.61 | M-02.3 165.74,64.77 164.78,65.72 164.78,67.97 161.88,70.87 158.75,70.87 158.12,71.51 158.12,74.3 154.94,77.47 v149.22,77.47 | 48.26,14.61 | 48.26,14.61 48.26,15.88 v51.44,19.05 | v101.6,72.52 101.73,72.52 105.41,76.2 110.49,76.2 v112.39,78.11
SCL  (via drill 0.9)
  Top 0.635: v149.86,36.2 128.91,36.2 118.11,25.4 118.05,25.4 v117.98,25.33
  Bottom 0.635: GPS-01.SCL 151.13,37.47 v149.86,36.2 | C-1.21 88.9,10.79 89.53,10.16 115.57,10.16 116.84,11.43 PIT-01.SCL/SCLK PIT-02.SCL/SCLK 118.11,25.4 118.05,25.4 v117.98,25.33
SDA  (via drill 0.9)
  Top 0.635: v118.24,21.59 v114.94,21.59 | v148.59,40.01 130.18,40.01 115.57,25.4 115.51,25.4 v115.44,25.33
  Bottom 0.635: v118.24,21.59 118.11,21.59 119.38,20.32 PIT-01.SDA/SDI 119.38,9.53 118.11,8.26 88.9,8.26 86.36,10.79 C-1.20 | v114.94,21.59 PIT-02.SDA/SDI 114.3,24.19 v115.44,25.33 | v148.59,40.01 GPS-01.SDA
TIT-01  (via drill 0.9)
  Top 0.635: v58.42,63.5 45.72,63.5 38.61,70.61 38.61,86.36 v38.86,86.61 | v153.42,75.18 v160.27,82.04
  Bottom 0.635: C-1.A2 v58.42,63.5 | v38.86,86.61 57.4,86.61 58.93,88.14 157.48,88.14 160.27,85.34 v160.27,82.04
  Bottom 1.016: v153.42,75.18 153.42,73.72 TIT-01.2
VBAT
  Bottom 1.016: J-01.1 arc90 8.89,77.65 8.89,81.28 arc-90 11.43,83.82 R2.P$2 VR-01.IN+ 53.98,83.82 arc-90 55.88,81.92 arc90 58.42,79.38 67.31,79.38 arc90 68.58,80.64 68.58,83.5 arc-90 VR-02.IN+ 71.44,86.36 156.84,86.36 158.12,85.09 158.12,78.74 159.38,77.47 169.54,77.47 170.81,76.2 170.81,50.8 | HE-02.1 169.37,43 170.81,44.45 170.81,50.8 | 170.81,50.8 170.18,50.8 167.78,50.8 HE-01.1
VBAT_SENSE
  Bottom 0.635: C-1.A3 arc-90 60.33,61.59 60.33,71.75 arc90 58.42,73.66 R3.P$2 R2.P$1
VCC_1  (via drill 0.9)
  Top 1.016: v58.42,85.09 57.78,85.72 40.64,85.72 40.64,76.2 | v40.64,71.12 40.64,76.2 | 104.78,64.14 104.78,73.03 101.6,76.2 40.64,76.2 | 104.78,64.14 104.78,55.88 107.31,53.34 v109.22,53.34 | 104.78,64.14 153.16,64.14 | 153.16,64.14 158.12,64.14 | 158.12,64.14 160.02,62.23 162.56,62.23 | 162.56,62.23 v164.47,62.23 | 158.12,64.14 160.66,66.67 160.66,70.48 162.56,72.39 v165.1,72.39 | 162.56,62.23 162.56,31.11 v160.02,28.57 | 153.16,64.14 153.16,68.33 150.11,71.37 144.53,71.37 v144.15,71.75
  Bottom 1.016: v58.42,85.09 59.69,83.82 VR-01.OUT+ | C-1.5V@0 v40.64,71.12 | v164.47,62.23 M-02.2 | v165.1,72.39 M-01.2 | IMU-01.VBAT v160.02,28.57 160.27,28.96 160.53,29.21 COMM-01.8 | v144.15,71.75 142.56,73.34 | v109.22,53.34 LC-01.HV
VCC_2  (via drill 0.9)
  Top 1.016: v113.03,27.3 120.44,34.72 120.85,34.72 120.85,53.14 v120.65,53.34
  Bottom 1.016: VR-02.OUT+ 111.12,83.82 120.38,74.56 120.38,55.44 120.61,55.21 120.65,55.17 | GPS-01.3V3 146.05,39.37 132.08,53.34 LC-01.LV 122.48,53.34 120.65,55.17 | PIT-01.3V3 122.44,19.57 122.44,19.89 123.62,21.07 124.46,21.07 126.48,23.1 126.48,24.97 124.15,27.3 v113.03,27.3 111.76,26.04 PIT-02.3V3 | v120.65,53.34 120.65,55.17

### Text on the board
tPlace: Servos | Heaters | Iridium Cable
tNames: + | -